# Altium schematic sheet LEDs.SchDoc
size A3
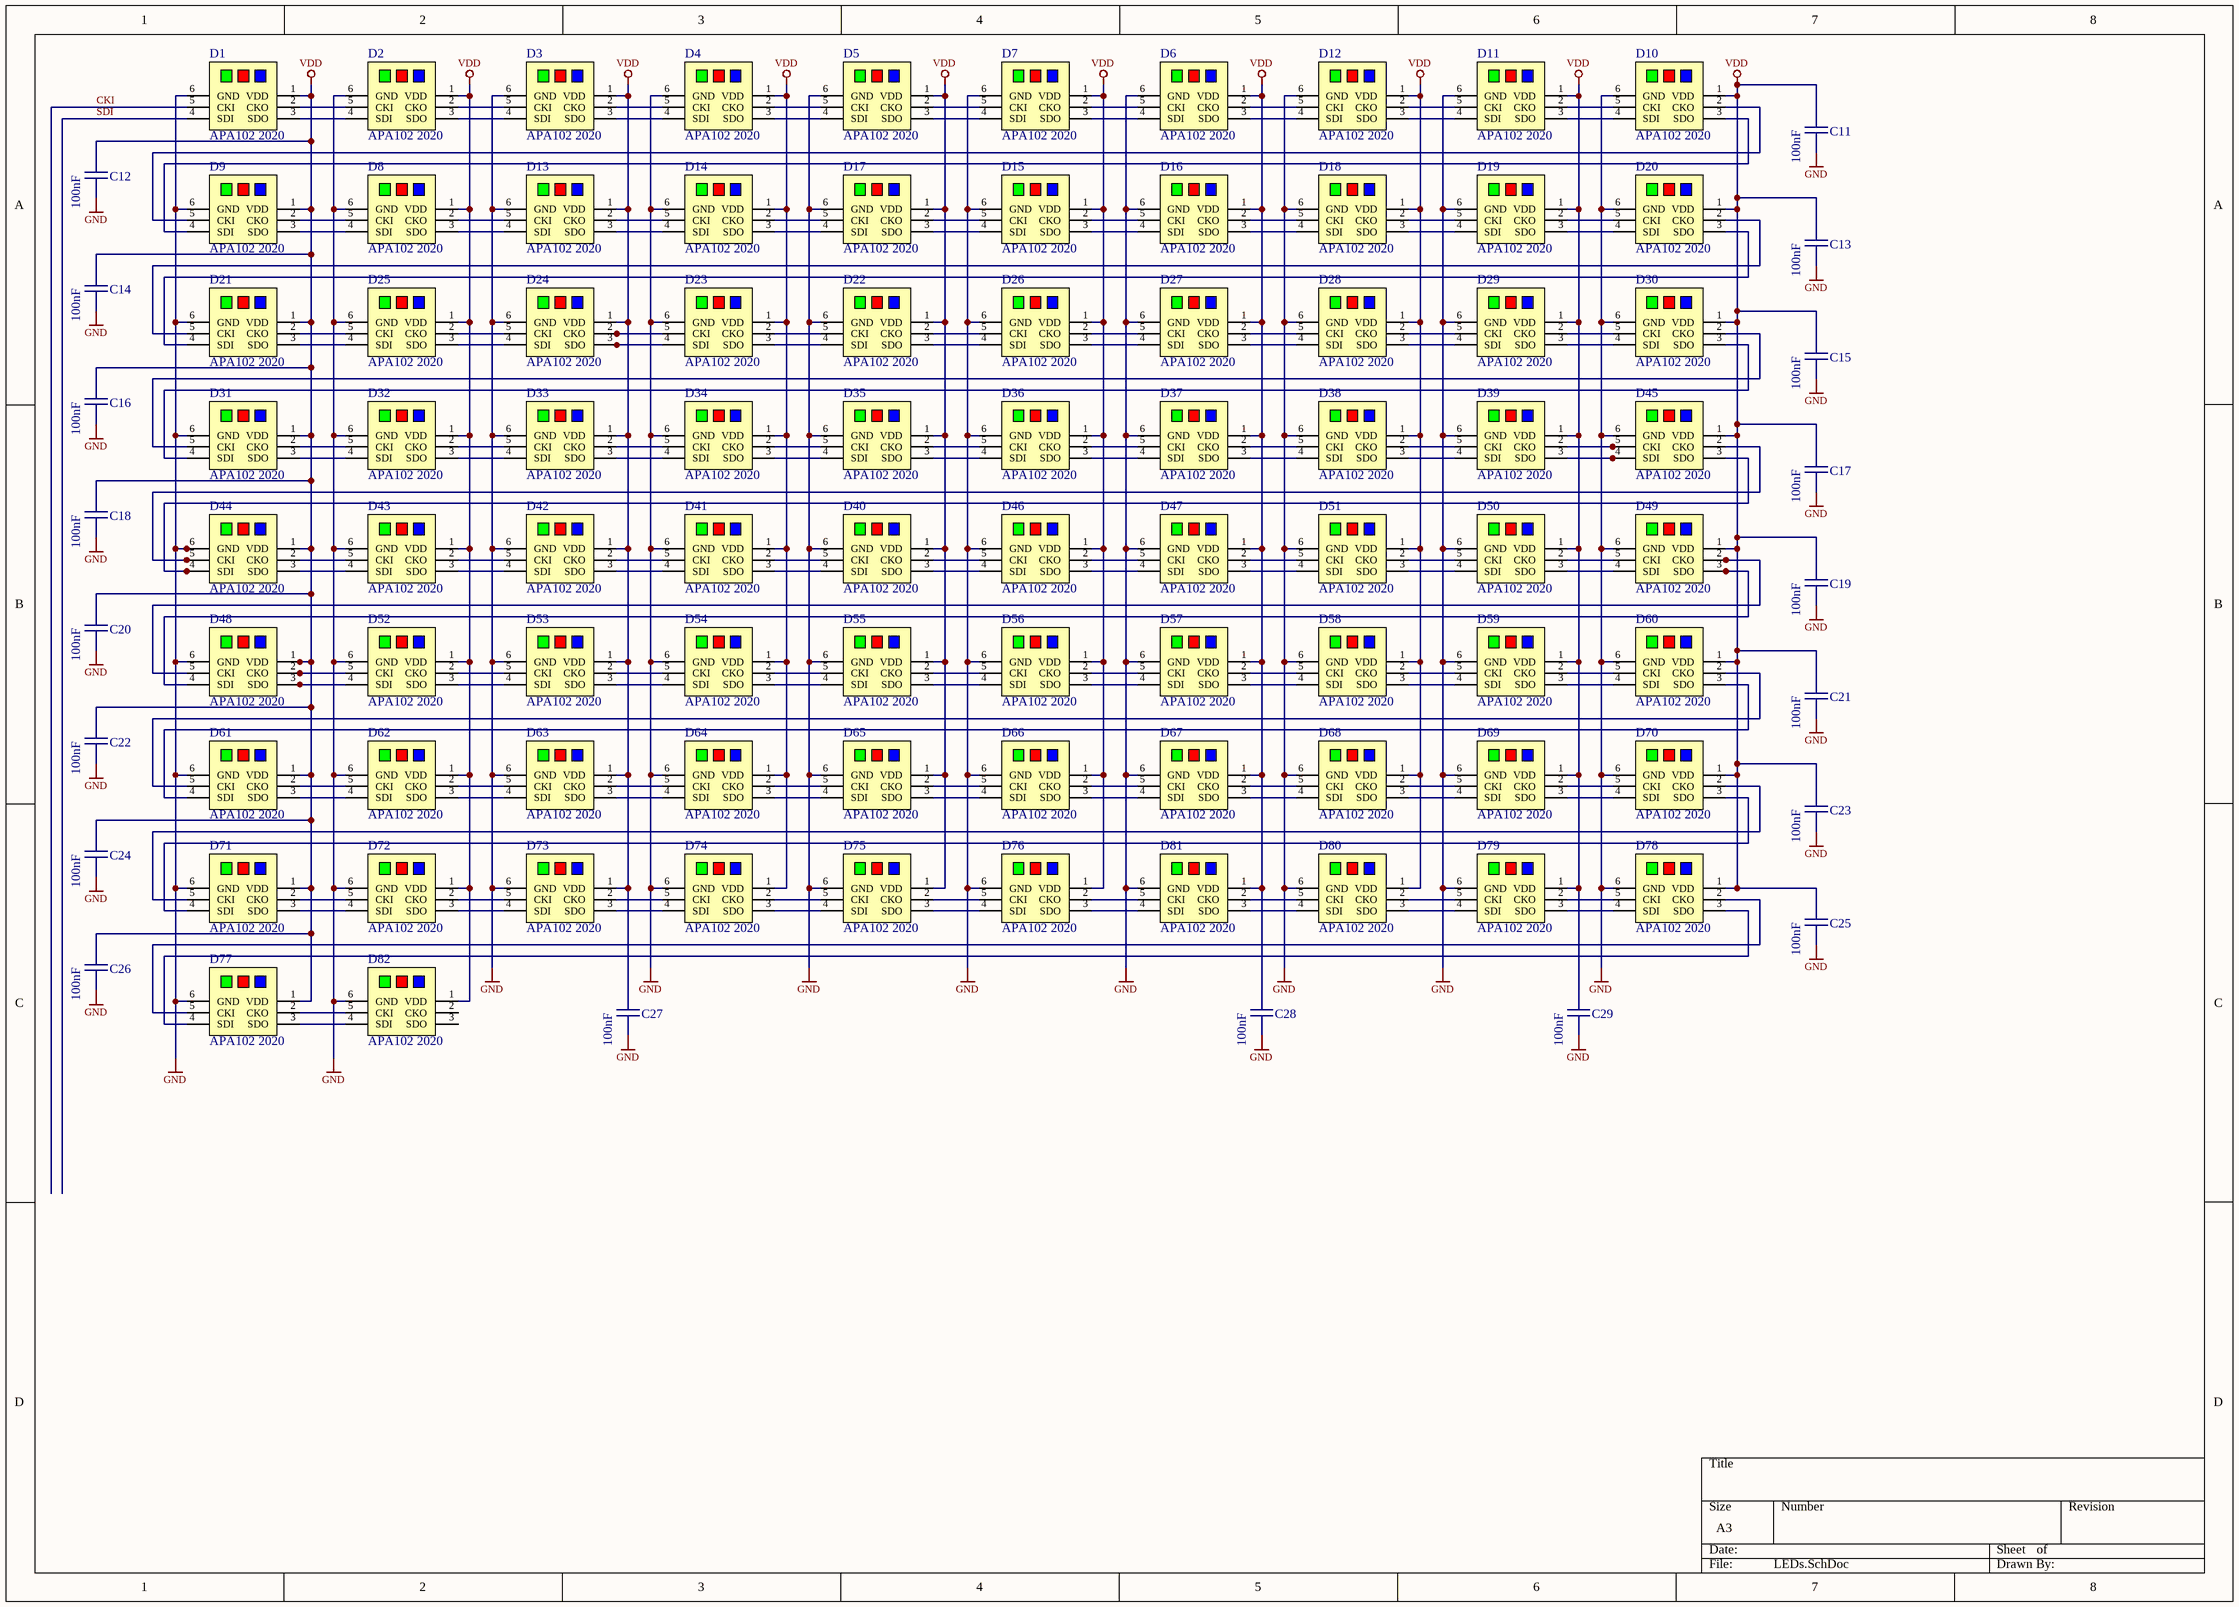
[diagram p0: LEDs.SchDoc]

## Parts
C11  100nF  [CAPC0603(1608)55_N]
C12  100nF  [CAPC0603(1608)55_N]
C13  100nF  [CAPC0603(1608)55_N]
C14  100nF  [CAPC0603(1608)55_N]
C15  100nF  [CAPC0603(1608)55_N]
C16  100nF  [CAPC0603(1608)55_N]
C17  100nF  [CAPC0603(1608)55_N]
C18  100nF  [CAPC0603(1608)55_N]
C19  100nF  [CAPC0603(1608)55_N]
C20  100nF  [CAPC0603(1608)55_N]
C21  100nF  [CAPC0603(1608)55_N]
C22  100nF  [CAPC0603(1608)55_N]
C23  100nF  [CAPC0603(1608)55_N]
C24  100nF  [CAPC0603(1608)55_N]
C25  100nF  [CAPC0603(1608)55_N]
C26  100nF  [CAPC0603(1608)55_N]
C27  100nF  [CAPC0603(1608)55_N]
C28  100nF  [CAPC0603(1608)55_N]
C29  100nF  [CAPC0603(1608)55_N]
D1  APA102 2020  [APA_RGB_LED_2020]
D2  APA102 2020  [APA_RGB_LED_2020]
D3  APA102 2020  [APA_RGB_LED_2020]
D4  APA102 2020  [APA_RGB_LED_2020]
D5  APA102 2020  [APA_RGB_LED_2020]
D6  APA102 2020  [APA_RGB_LED_2020]
D7  APA102 2020  [APA_RGB_LED_2020]
D8  APA102 2020  [APA_RGB_LED_2020]
D9  APA102 2020  [APA_RGB_LED_2020]
D10  APA102 2020  [APA_RGB_LED_2020]
D11  APA102 2020  [APA_RGB_LED_2020]
D12  APA102 2020  [APA_RGB_LED_2020]
D13  APA102 2020  [APA_RGB_LED_2020]
D14  APA102 2020  [APA_RGB_LED_2020]
D15  APA102 2020  [APA_RGB_LED_2020]
D16  APA102 2020  [APA_RGB_LED_2020]
D17  APA102 2020  [APA_RGB_LED_2020]
D18  APA102 2020  [APA_RGB_LED_2020]
D19  APA102 2020  [APA_RGB_LED_2020]
D20  APA102 2020  [APA_RGB_LED_2020]
D21  APA102 2020  [APA_RGB_LED_2020]
D22  APA102 2020  [APA_RGB_LED_2020]
D23  APA102 2020  [APA_RGB_LED_2020]
D24  APA102 2020  [APA_RGB_LED_2020]
D25  APA102 2020  [APA_RGB_LED_2020]
D26  APA102 2020  [APA_RGB_LED_2020]
D27  APA102 2020  [APA_RGB_LED_2020]
D28  APA102 2020  [APA_RGB_LED_2020]
D29  APA102 2020  [APA_RGB_LED_2020]
D30  APA102 2020  [APA_RGB_LED_2020]
D31  APA102 2020  [APA_RGB_LED_2020]
D32  APA102 2020  [APA_RGB_LED_2020]
D33  APA102 2020  [APA_RGB_LED_2020]
D34  APA102 2020  [APA_RGB_LED_2020]
D35  APA102 2020  [APA_RGB_LED_2020]
D36  APA102 2020  [APA_RGB_LED_2020]
D37  APA102 2020  [APA_RGB_LED_2020]
D38  APA102 2020  [APA_RGB_LED_2020]
D39  APA102 2020  [APA_RGB_LED_2020]
D40  APA102 2020  [APA_RGB_LED_2020]
D41  APA102 2020  [APA_RGB_LED_2020]
D42  APA102 2020  [APA_RGB_LED_2020]
D43  APA102 2020  [APA_RGB_LED_2020]
D44  APA102 2020  [APA_RGB_LED_2020]
D45  APA102 2020  [APA_RGB_LED_2020]
D46  APA102 2020  [APA_RGB_LED_2020]
D47  APA102 2020  [APA_RGB_LED_2020]
D48  APA102 2020  [APA_RGB_LED_2020]
D49  APA102 2020  [APA_RGB_LED_2020]
D50  APA102 2020  [APA_RGB_LED_2020]
D51  APA102 2020  [APA_RGB_LED_2020]
D52  APA102 2020  [APA_RGB_LED_2020]
D53  APA102 2020  [APA_RGB_LED_2020]
D54  APA102 2020  [APA_RGB_LED_2020]
D55  APA102 2020  [APA_RGB_LED_2020]
D56  APA102 2020  [APA_RGB_LED_2020]
D57  APA102 2020  [APA_RGB_LED_2020]
D58  APA102 2020  [APA_RGB_LED_2020]
D59  APA102 2020  [APA_RGB_LED_2020]
D60  APA102 2020  [APA_RGB_LED_2020]
D61  APA102 2020  [APA_RGB_LED_2020]
D62  APA102 2020  [APA_RGB_LED_2020]
D63  APA102 2020  [APA_RGB_LED_2020]
D64  APA102 2020  [APA_RGB_LED_2020]
D65  APA102 2020  [APA_RGB_LED_2020]
D66  APA102 2020  [APA_RGB_LED_2020]
D67  APA102 2020  [APA_RGB_LED_2020]
D68  APA102 2020  [APA_RGB_LED_2020]
D69  APA102 2020  [APA_RGB_LED_2020]
D70  APA102 2020  [APA_RGB_LED_2020]
D71  APA102 2020  [APA_RGB_LED_2020]
D72  APA102 2020  [APA_RGB_LED_2020]
D73  APA102 2020  [APA_RGB_LED_2020]
D74  APA102 2020  [APA_RGB_LED_2020]
D75  APA102 2020  [APA_RGB_LED_2020]
D76  APA102 2020  [APA_RGB_LED_2020]
D77  APA102 2020  [APA_RGB_LED_2020]
D78  APA102 2020  [APA_RGB_LED_2020]
D79  APA102 2020  [APA_RGB_LED_2020]
D80  APA102 2020  [APA_RGB_LED_2020]
D81  APA102 2020  [APA_RGB_LED_2020]
D82  APA102 2020  [APA_RGB_LED_2020]

## Nets
GND: C11.1 C12.1 C13.1 C14.1 C15.1 C16.1 C17.1 C18.1 C19.1 C20.1 C21.1 C22.1 C23.1 C24.1 C25.1 C26.1 C27.1 C28.1 C29.1 D1.6(GND) D2.6(GND) D3.6(GND) D4.6(GND) D5.6(GND) D6.6(GND) D7.6(GND) D8.6(GND) D9.6(GND) D10.6(GND) D11.6(GND) D12.6(GND) D13.6(GND) D14.6(GND) D15.6(GND) D16.6(GND) D17.6(GND) D18.6(GND) D19.6(GND) D20.6(GND) D21.6(GND) D22.6(GND) D23.6(GND) D24.6(GND) D25.6(GND) D26.6(GND) D27.6(GND) D28.6(GND) D29.6(GND) D30.6(GND) D31.6(GND) D32.6(GND) D33.6(GND) D34.6(GND) D35.6(GND) D36.6(GND) D37.6(GND) D38.6(GND) D39.6(GND) D40.6(GND) D41.6(GND) D42.6(GND) D43.6(GND) D44.6(GND) D45.6(GND) D46.6(GND) D47.6(GND) D48.6(GND) D49.6(GND) D50.6(GND) D51.6(GND) D52.6(GND) D53.6(GND) D54.6(GND) D55.6(GND) D56.6(GND) D57.6(GND) D58.6(GND) D59.6(GND) D60.6(GND) D61.6(GND) D62.6(GND) D63.6(GND) D64.6(GND) D65.6(GND) D66.6(GND) D67.6(GND) D68.6(GND) D69.6(GND) D70.6(GND) D71.6(GND) D72.6(GND) D73.6(GND) D74.6(GND) D75.6(GND) D76.6(GND) D77.6(GND) D78.6(GND) D79.6(GND) D80.6(GND) D81.6(GND) D82.6(GND)
VDD: C11.2 C12.2 C13.2 C14.2 C15.2 C16.2 C17.2 C18.2 C19.2 C20.2 C21.2 C22.2 C23.2 C24.2 C25.2 C26.2 C27.2 C28.2 C29.2 D1.1(VDD) D2.1(VDD) D3.1(VDD) D4.1(VDD) D5.1(VDD) D6.1(VDD) D7.1(VDD) D8.1(VDD) D9.1(VDD) D10.1(VDD) D11.1(VDD) D12.1(VDD) D13.1(VDD) D14.1(VDD) D15.1(VDD) D16.1(VDD) D17.1(VDD) D18.1(VDD) D19.1(VDD) D20.1(VDD) D21.1(VDD) D22.1(VDD) D23.1(VDD) D24.1(VDD) D25.1(VDD) D26.1(VDD) D27.1(VDD) D28.1(VDD) D29.1(VDD) D30.1(VDD) D31.1(VDD) D32.1(VDD) D33.1(VDD) D34.1(VDD) D35.1(VDD) D36.1(VDD) D37.1(VDD) D38.1(VDD) D39.1(VDD) D40.1(VDD) D41.1(VDD) D42.1(VDD) D43.1(VDD) D44.1(VDD) D45.1(VDD) D46.1(VDD) D47.1(VDD) D48.1(VDD) D49.1(VDD) D50.1(VDD) D51.1(VDD) D52.1(VDD) D53.1(VDD) D54.1(VDD) D55.1(VDD) D56.1(VDD) D57.1(VDD) D58.1(VDD) D59.1(VDD) D60.1(VDD) D61.1(VDD) D62.1(VDD) D63.1(VDD) D64.1(VDD) D65.1(VDD) D66.1(VDD) D67.1(VDD) D68.1(VDD) D69.1(VDD) D70.1(VDD) D71.1(VDD) D72.1(VDD) D73.1(VDD) D74.1(VDD) D75.1(VDD) D76.1(VDD) D77.1(VDD) D78.1(VDD) D79.1(VDD) D80.1(VDD) D81.1(VDD) D82.1(VDD)
CKI: D1.5(CKI)
SDI: D1.4(SDI)
NetD1_2: D1.2(CKO) D2.5(CKI)
NetD1_3: D1.3(SDO) D2.4(SDI)
NetD2_2: D2.2(CKO) D3.5(CKI)
NetD2_3: D2.3(SDO) D3.4(SDI)
NetD3_2: D3.2(CKO) D4.5(CKI)
NetD3_3: D3.3(SDO) D4.4(SDI)
NetD4_2: D4.2(CKO) D5.5(CKI)
NetD4_3: D4.3(SDO) D5.4(SDI)
NetD5_2: D5.2(CKO) D7.5(CKI)
NetD5_3: D5.3(SDO) D7.4(SDI)
NetD6_2: D6.2(CKO) D12.5(CKI)
NetD6_3: D6.3(SDO) D12.4(SDI)
NetD6_4: D6.4(SDI) D7.3(SDO)
NetD6_5: D6.5(CKI) D7.2(CKO)
NetD8_2: D8.2(CKO) D13.5(CKI)
NetD8_3: D8.3(SDO) D13.4(SDI)
NetD8_4: D8.4(SDI) D9.3(SDO)
NetD8_5: D8.5(CKI) D9.2(CKO)
NetD9_4: D9.4(SDI) D10.3(SDO)
NetD9_5: D9.5(CKI) D10.2(CKO)
NetD10_4: D10.4(SDI) D11.3(SDO)
NetD10_5: D10.5(CKI) D11.2(CKO)
NetD11_4: D11.4(SDI) D12.3(SDO)
NetD11_5: D11.5(CKI) D12.2(CKO)
NetD13_2: D13.2(CKO) D14.5(CKI)
NetD13_3: D13.3(SDO) D14.4(SDI)
NetD14_2: D14.2(CKO) D17.5(CKI)
NetD14_3: D14.3(SDO) D17.4(SDI)
NetD15_2: D15.2(CKO) D16.5(CKI)
NetD15_3: D15.3(SDO) D16.4(SDI)
NetD15_4: D15.4(SDI) D17.3(SDO)
NetD15_5: D15.5(CKI) D17.2(CKO)
NetD16_2: D16.2(CKO) D18.5(CKI)
NetD16_3: D16.3(SDO) D18.4(SDI)
NetD18_2: D18.2(CKO) D19.5(CKI)
NetD18_3: D18.3(SDO) D19.4(SDI)
NetD19_2: D19.2(CKO) D20.5(CKI)
NetD19_3: D19.3(SDO) D20.4(SDI)
NetD20_2: D20.2(CKO) D21.5(CKI)
NetD20_3: D20.3(SDO) D21.4(SDI)
NetD21_2: D21.2(CKO) D25.5(CKI)
NetD21_3: D21.3(SDO) D25.4(SDI)
NetD22_2: D22.2(CKO) D26.5(CKI)
NetD22_3: D22.3(SDO) D26.4(SDI)
NetD22_4: D22.4(SDI) D23.3(SDO)
NetD22_5: D22.5(CKI) D23.2(CKO)
NetD23_4: D23.4(SDI) D24.3(SDO)
NetD23_5: D23.5(CKI) D24.2(CKO)
NetD24_4: D24.4(SDI) D25.3(SDO)
NetD24_5: D24.5(CKI) D25.2(CKO)
NetD26_2: D26.2(CKO) D27.5(CKI)
NetD26_3: D26.3(SDO) D27.4(SDI)
NetD27_2: D27.2(CKO) D28.5(CKI)
NetD27_3: D27.3(SDO) D28.4(SDI)
NetD28_2: D28.2(CKO) D29.5(CKI)
NetD28_3: D28.3(SDO) D29.4(SDI)
NetD29_2: D29.2(CKO) D30.5(CKI)
NetD29_3: D29.3(SDO) D30.4(SDI)
NetD30_2: D30.2(CKO) D31.5(CKI)
NetD30_3: D30.3(SDO) D31.4(SDI)
NetD31_2: D31.2(CKO) D32.5(CKI)
NetD31_3: D31.3(SDO) D32.4(SDI)
NetD32_2: D32.2(CKO) D33.5(CKI)
NetD32_3: D32.3(SDO) D33.4(SDI)
NetD33_2: D33.2(CKO) D34.5(CKI)
NetD33_3: D33.3(SDO) D34.4(SDI)
NetD34_2: D34.2(CKO) D35.5(CKI)
NetD34_3: D34.3(SDO) D35.4(SDI)
NetD35_2: D35.2(CKO) D36.5(CKI)
NetD35_3: D35.3(SDO) D36.4(SDI)
NetD36_2: D36.2(CKO) D37.5(CKI)
NetD36_3: D36.3(SDO) D37.4(SDI)
NetD37_2: D37.2(CKO) D38.5(CKI)
NetD37_3: D37.3(SDO) D38.4(SDI)
NetD38_2: D38.2(CKO) D39.5(CKI)
NetD38_3: D38.3(SDO) D39.4(SDI)
NetD39_2: D39.2(CKO) D45.5(CKI)
NetD39_3: D39.3(SDO) D45.4(SDI)
NetD40_2: D40.2(CKO) D46.5(CKI)
NetD40_3: D40.3(SDO) D46.4(SDI)
NetD40_4: D40.4(SDI) D41.3(SDO)
NetD40_5: D40.5(CKI) D41.2(CKO)
NetD41_4: D41.4(SDI) D42.3(SDO)
NetD41_5: D41.5(CKI) D42.2(CKO)
NetD42_4: D42.4(SDI) D43.3(SDO)
NetD42_5: D42.5(CKI) D43.2(CKO)
NetD43_4: D43.4(SDI) D44.3(SDO)
NetD43_5: D43.5(CKI) D44.2(CKO)
NetD44_4: D44.4(SDI) D45.3(SDO)
NetD44_5: D44.5(CKI) D45.2(CKO)
NetD46_2: D46.2(CKO) D47.5(CKI)
NetD46_3: D46.3(SDO) D47.4(SDI)
NetD47_2: D47.2(CKO) D51.5(CKI)
NetD47_3: D47.3(SDO) D51.4(SDI)
NetD48_2: D48.2(CKO) D52.5(CKI)
NetD48_3: D48.3(SDO) D52.4(SDI)
NetD48_4: D48.4(SDI) D49.3(SDO)
NetD48_5: D48.5(CKI) D49.2(CKO)
NetD49_4: D49.4(SDI) D50.3(SDO)
NetD49_5: D49.5(CKI) D50.2(CKO)
NetD50_4: D50.4(SDI) D51.3(SDO)
NetD50_5: D50.5(CKI) D51.2(CKO)
NetD52_2: D52.2(CKO) D53.5(CKI)
NetD52_3: D52.3(SDO) D53.4(SDI)
NetD53_2: D53.2(CKO) D54.5(CKI)
NetD53_3: D53.3(SDO) D54.4(SDI)
NetD54_2: D54.2(CKO) D55.5(CKI)
NetD54_3: D54.3(SDO) D55.4(SDI)
NetD55_2: D55.2(CKO) D56.5(CKI)
NetD55_3: D55.3(SDO) D56.4(SDI)
NetD56_2: D56.2(CKO) D57.5(CKI)
NetD56_3: D56.3(SDO) D57.4(SDI)
NetD57_2: D57.2(CKO) D58.5(CKI)
NetD57_3: D57.3(SDO) D58.4(SDI)
NetD58_2: D58.2(CKO) D59.5(CKI)
NetD58_3: D58.3(SDO) D59.4(SDI)
NetD59_2: D59.2(CKO) D60.5(CKI)
NetD59_3: D59.3(SDO) D60.4(SDI)
NetD60_2: D60.2(CKO) D61.5(CKI)
NetD60_3: D60.3(SDO) D61.4(SDI)
NetD61_2: D61.2(CKO) D62.5(CKI)
NetD61_3: D61.3(SDO) D62.4(SDI)
NetD62_2: D62.2(CKO) D63.5(CKI)
NetD62_3: D62.3(SDO) D63.4(SDI)
NetD63_2: D63.2(CKO) D64.5(CKI)
NetD63_3: D63.3(SDO) D64.4(SDI)
NetD64_2: D64.2(CKO) D65.5(CKI)
NetD64_3: D64.3(SDO) D65.4(SDI)
NetD65_2: D65.2(CKO) D66.5(CKI)
NetD65_3: D65.3(SDO) D66.4(SDI)
NetD66_2: D66.2(CKO) D67.5(CKI)
NetD66_3: D66.3(SDO) D67.4(SDI)
NetD67_2: D67.2(CKO) D68.5(CKI)
NetD67_3: D67.3(SDO) D68.4(SDI)
NetD68_2: D68.2(CKO) D69.5(CKI)
NetD68_3: D68.3(SDO) D69.4(SDI)
NetD69_2: D69.2(CKO) D70.5(CKI)
NetD69_3: D69.3(SDO) D70.4(SDI)
NetD70_2: D70.2(CKO) D71.5(CKI)
NetD70_3: D70.3(SDO) D71.4(SDI)
NetD71_2: D71.2(CKO) D72.5(CKI)
NetD71_3: D71.3(SDO) D72.4(SDI)
NetD72_2: D72.2(CKO) D73.5(CKI)
NetD72_3: D72.3(SDO) D73.4(SDI)
NetD73_2: D73.2(CKO) D74.5(CKI)
NetD73_3: D73.3(SDO) D74.4(SDI)
NetD74_2: D74.2(CKO) D75.5(CKI)
NetD74_3: D74.3(SDO) D75.4(SDI)
NetD75_2: D75.2(CKO) D76.5(CKI)
NetD75_3: D75.3(SDO) D76.4(SDI)
NetD76_2: D76.2(CKO) D81.5(CKI)
NetD76_3: D76.3(SDO) D81.4(SDI)
NetD77_2: D77.2(CKO) D82.5(CKI)
NetD77_3: D77.3(SDO) D82.4(SDI)
NetD77_4: D77.4(SDI) D78.3(SDO)
NetD77_5: D77.5(CKI) D78.2(CKO)
NetD78_4: D78.4(SDI) D79.3(SDO)
NetD78_5: D78.5(CKI) D79.2(CKO)
NetD79_4: D79.4(SDI) D80.3(SDO)
NetD79_5: D79.5(CKI) D80.2(CKO)
NetD80_4: D80.4(SDI) D81.3(SDO)
NetD80_5: D80.5(CKI) D81.2(CKO)

Not connected (* = marked no-connect by the designer): D82 2(CKO) 3(SDO)

## Library data of the parts
C11-C29 = 5152: pakke_opprettet_av: 815; leverandor_varenr: 1759122; pris: 1; nokkelord: Kondensator, Capacitor, CAP; pakketype: 0603; produsent: Multicomp; leverandor: Farnell; id: 5152; rad: 21; rom: OV; lager_type: Baklager; dybde: 0; antall: 985; beskrivelse: X7R 50V 5%; komponenttype: 2; navn: 100nF; pakke_opprettet: 18/02/2015 14:18:13; symbol_opprettet_av: 815; symbol_opprettet: 14/11/2014 20:19:34; hylle: 0; elektrisk_verdi: 100nF
D1-D82 = 5672: AdaFruit: 3341; id: 5672; pakke_opprettet_av: 815; beskrivelse: 2x2mm SMD RGB Addresserbar LED; leverandor_varenr: 1528-2392-ND; pris: 0; nokkelord: Adafruit: 3341; produsent: Kina; leverandor: DigiKey; pakketype: SMD; komponenttype: 9; DigiKey: 1528-2392-ND; pakke_opprettet: 08/02/2020 14:20:14; symbol_opprettet_av: 815; symbol_opprettet: 08/02/2020 14:20:38; navn: APA102 2020